# Altium project wikiduino-micro-rda5981.PrjPCB
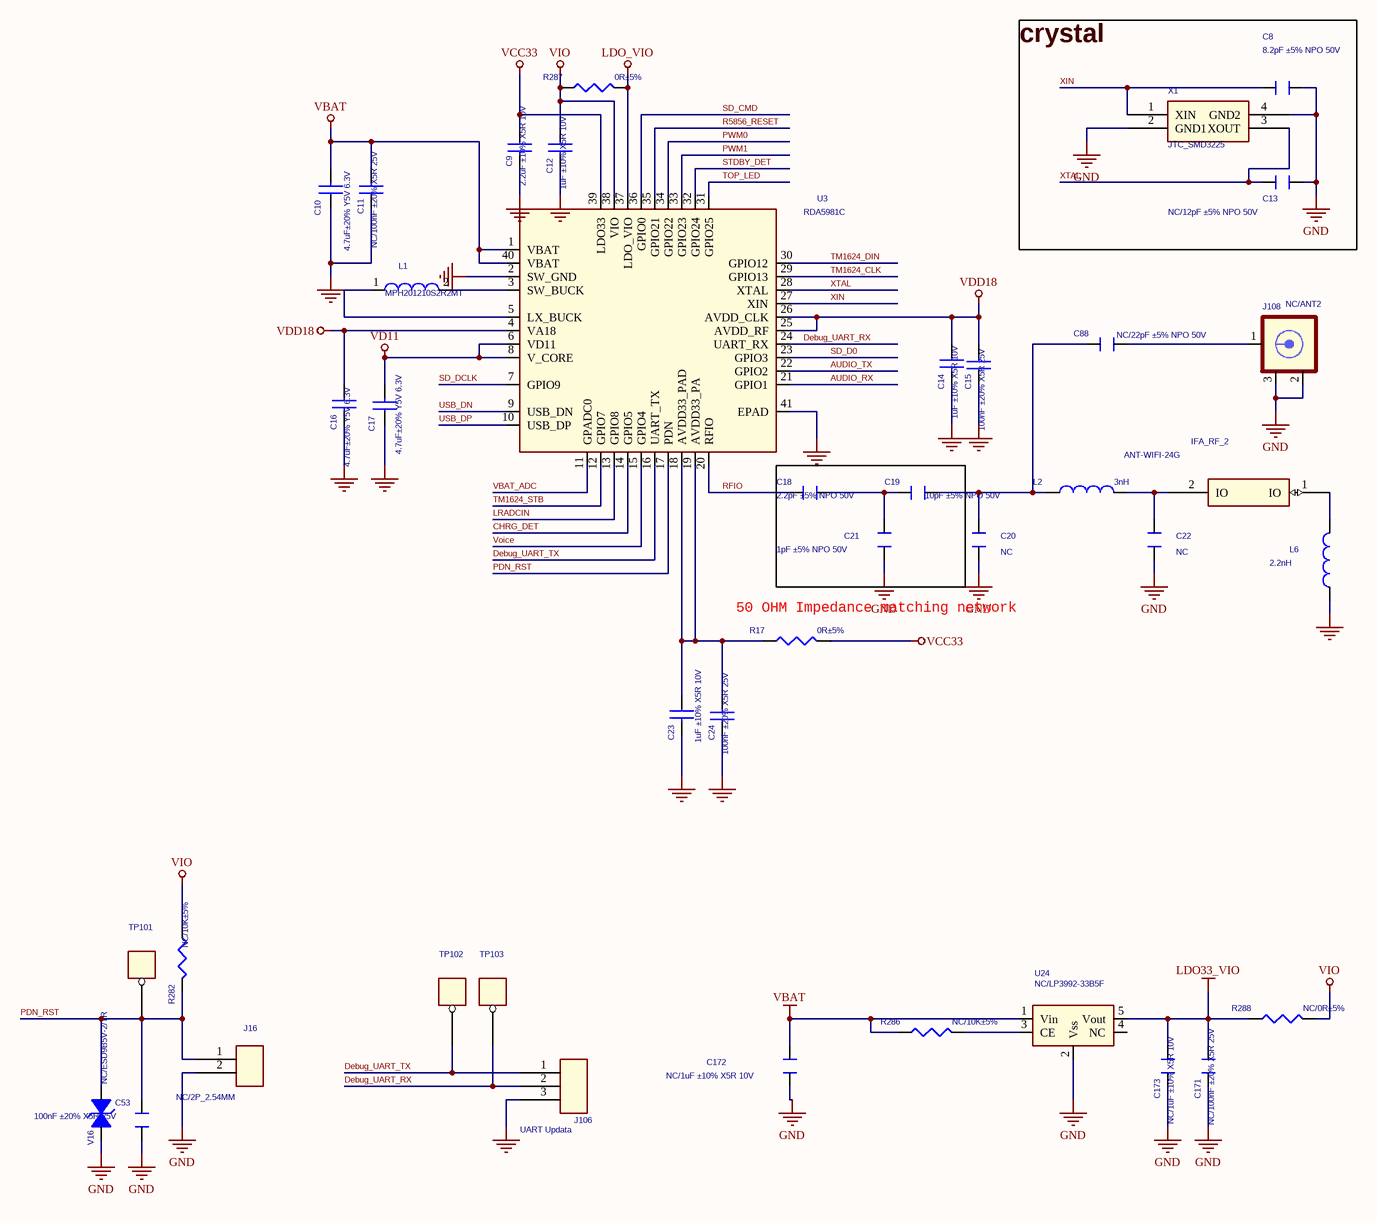
[diagram p0: RDA5981C.SchDoc]
2 sheets, 79 parts. Net scope: global (net labels, ports and power ports of the same name join across sheets).
Board file: wikiduino-micro-rda5981.PcbDoc
Sheets:
  RDA5981C.SchDoc
  POWER.SchDoc

## Sheet RDA5981C.SchDoc
size A3

### Parts
C8  8.2pF ±5% NPO 50V  [C0402]
C9  2.2uF ±10% X5R 10V  [C0402]
C10  4.7uF±20% Y5V 6.3V  [C0402]
C11  NC/100nF ±20% X5R 25V  [C0402]
C12  1uF ±10% X5R 10V  [C0402]
C13  NC/12pF ±5% NPO 50V  [C0402]
C14  1uF ±10% X5R 10V  [C0402]
C15  100nF ±20% X5R 25V  [C0402]
C16  4.7uF±20% Y5V 6.3V  [C0402]
C17  4.7uF±20% Y5V 6.3V  [C0402]
C18  2.2pF ±5% NPO 50V  [C0402]
C19  10pF ±5% NPO 50V  [C0402]
C20  NC  [C0402]
C21  1pF ±5% NPO 50V  [C0402]
C22  NC  [C0402]
C23  1uF ±10% X5R 10V  [C0402]
C24  100nF ±20% X5R 25V  [C0402]
C53  100nF ±20% X5R 25V  [C0402]
C88  NC/22pF ±5% NPO 50V  [C0402]
C171  NC/100nF ±20% X5R 25V  [C0402]
C172  NC/1uF ±10% X5R 10V  [C0402]
C173  NC/1uF ±10% X5R 10V  [C0402]
IFA_RF_2  ANT-WIFI-24G  [IFA_RF_1]
J16  NC/2P_2.54MM  [SIP100-2P]
J106  UART Updata  [SIP100-3P]
J108  NC/ANT2  [ANT]
L1  MPH201210S2R2MT  [L0805]
L2  3nH  [L0402]
L6  2.2nH  [L0402]
R17  0R±5%  [R0402]
R282  NC/10K±5%  [R0402]
R286  NC/10K±5%  [R0402]
R287  0R±5%  [R0402]
R288  NC/0R±5%  [R0402]
TP101  TP25RD  [TPC]  (value not drawn)
TP102  TP25RD  [TPC]  (value not drawn)
TP103  TP25RD  [TPC]  (value not drawn)
U3  RDA5981C  [QFN40-5X5-T1.0-RDA5981C]
U24  NC/LP3992-33B5F  [SOT23-6]
V16  NC/ESD9B5V-2/TR  [ESD0402]
X1  JTC_SMD3225  [SMD_3225]

### Blocks framed on the sheet
crystal: C8 C13 X1

### Nets
GND: C8.1 C9.2 C10.1 C11.1 C12.2 C13.1 C14.2 C15.1 C16.2 C17.1 C20.2 C21.2 C22.2 C23.2 C24.1 C53.1 C171.1 C172.1 C173.1 J16.2 J106.3 J108.2(SHIELD1) J108.3(SHIELD2) L6.1 U3.2(SW_GND) U3.41(EPAD) U24.2(Vss) V16.2(I/O2) X1.2(GND1) X1.4(GND2)
LDO33_VIO: C171.2 C173.2 R288.1 U24.5(Vout)
LDO_VIO: R287.2 U3.37(LDO_VIO)
VBAT: C10.2 C11.2 C172.2 R286.1 U3.1(VBAT) U3.40(VBAT) U24.1(Vin)
VCC33: C9.1 R17.2 U3.39(LDO33)
VD11: C17.2 U3.6(VD11) U3.8(V_CORE)
VDD18: C14.1 C15.2 C16.1 U3.4(VA18) U3.25(AVDD_RF) U3.26(AVDD_CLK)
VIO: C12.1 R282.1 R287.1 R288.2 U3.38(VIO)
AUDIO_RX: U3.21(GPIO1)
AUDIO_TX: U3.22(GPIO2)
CHRG_DET: U3.14(GPIO5)
Debug_UART_RX: J106.2 TP103.1(TP1) U3.24(UART_RX)
Debug_UART_TX: J106.1 TP102.1(TP1) U3.16(UART_TX)
LRADCIN: U3.13(GPIO8)
PDN_RST: C53.2 J16.1 R282.2 TP101.1(TP1) U3.17(PDN) V16.1(I/O1)
PWM0: U3.34(GPIO22)
PWM1: U3.33(GPIO23)
R5856_RESET: U3.35(GPIO21)
RFIO: C18.2 U3.20(RFIO)
SD_CMD: U3.36(GPIO0)
SD_D0: U3.23(GPIO3)
SD_DCLK: U3.7(GPIO9)
STDBY_DET: U3.32(GPIO24)
TM1624_CLK: U3.29(GPIO13)
TM1624_DIN: U3.30(GPIO12)
TM1624_STB: U3.12(GPIO7)
TOP_LED: U3.31(GPIO25)
USB_DN: U3.9(USB_DN)
USB_DP: U3.10(USB_DP)
VBAT_ADC: U3.11(GPADC0)
Voice: U3.15(GPIO4)
XIN: C8.2 U3.27(XIN) X1.1(XIN)
XTAL: C13.2 U3.28(XTAL) X1.3(XOUT)
NetC18_1: C18.1 C19.2 C21.1
NetC19_1: C19.1 C20.1 C88.2 L2.1
NetC22_1: C22.1 IFA_RF_2.2(IO) L2.2
NetC23_1: C23.1 C24.2 R17.1 U3.18(AVDD33_PAD) U3.19(AVDD33_PA)
NetC88_1: C88.1 J108.1(CENTER)
NetIFA_RF_2_1: IFA_RF_2.1(IO) L6.2
NetL1_1: L1.1 U3.5(LX_BUCK)
NetL1_2: L1.2 U3.3(SW_BUCK)
NetR286_2: R286.2 U24.3(CE)

Not connected (* = marked no-connect by the designer): U24 4(NC)

### Notes on the sheet
- (near R17) 50 OHM Impedance matching network

### Library data of the parts
C8 C13 C20-C22 C53 = CAPACITOR_0_Dup4: PAGE: 2
C9 C12 C14 C16 C23 = CAP NP_Dup6
C10 C17 = CAP NP_Dup4: Assembly: C0603
C11 C15 C24 = CAP NP_Dup5
C18 C19 C88 = CAPACITOR_Dup2
C171-C173 = CAPACITOR_Dup2: PAGE: 1
IFA_RF_2 = ANT-25G-R-CB_0
J16 = CON4_1
J106 = CON3
J108 = SMA/RF_0
L1 = INDUCTOR: RoHS Power Inductor 22uH 300mA H<1.8MM,CD32
L2 L6 = INDUCTOR_Dup1: PART_TYPE: L42; PART_NUMBER: L42-0201S3N320ACX0
R17 R282 = R_Dup2: ROOM: TFCARD&USB&KEY
R286-R288 = R_Dup3
TP101 TP102 = TEST_POINT: PAD_SM;TEST;0.025 ROUND; Part Number: G500-0000506; Type Package: SM PAD; BOM Notes: DNE; Compliance: NoData; Part Type: TEST POINT; Lifecycle: Full Production
TP103 = TEST_POINT: PAD_SM;TEST;0.025 ROUND; Part Number: G500-0000506; Compliance: NoData; BOM Notes: DNE; Type Package: SM PAD; Lifecycle: Full Production; Part Type: TEST POINT
U3 = RDA5981C_0
U24 = RT9266PE_12
V16 = Varistor: Mutilayer Varistor,,5.5V,10PF; Manufacturer: Inpaq; Part_Number: EB3.100NV05402A; Part_Name: Varistor
X1 = CRYSTAL-4_0: Crystal 24MHz 20pF 10ppm  -30 to +85; PART NUMBER: 7M24000004; Vendor: TXC; SPREADWIN PN: U3000019A

## Sheet POWER.SchDoc
size 386 x 304 mm
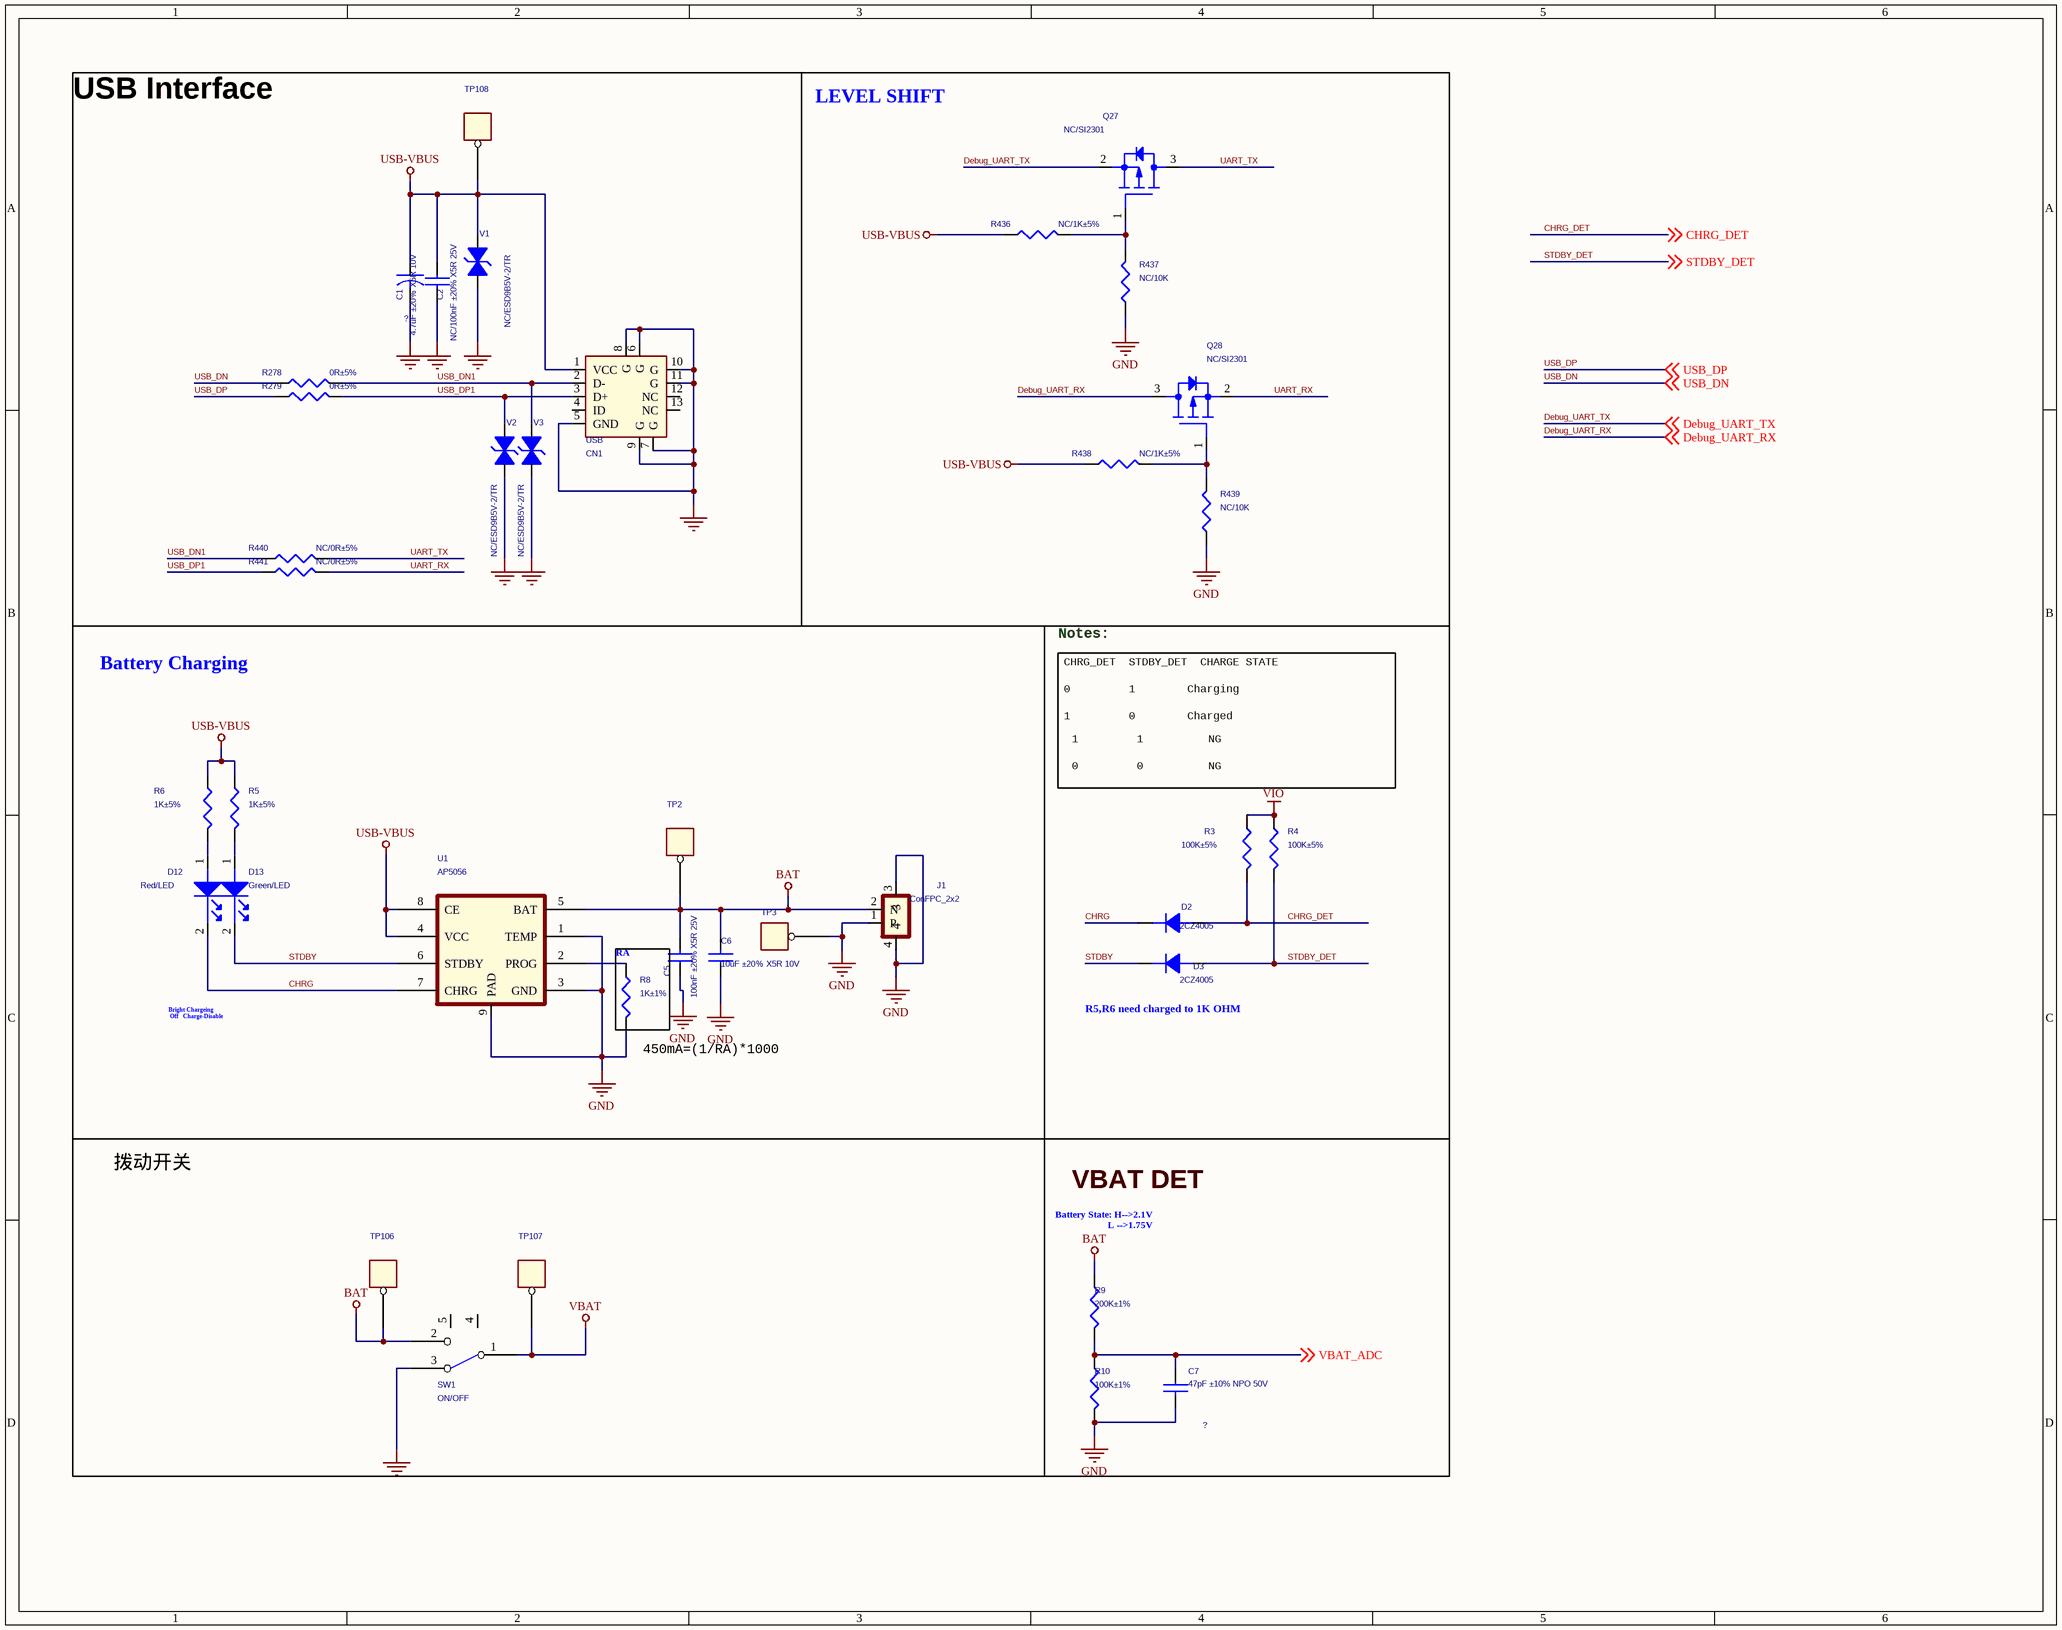
[diagram p1: POWER.SchDoc]

### Parts
C1  4.7uF ±20％ X5R 10V  [C0402]
C2  NC/100nF ±20% X5R 25V  [C0402]
C5  100nF ±20% X5R 25V  [C0402]
C6  10uF ±20％ X5R 10V  [C0603]
C7  47pF ±10% NPO 50V  [C0402]
CN1  USB  [USB_DIP5PA-GKFD]
D2  2CZ4005  [SOD-123]
D3  2CZ4005  [SOD-123]
D12  Red/LED  [LED0603]
D13  Green/LED  [LED0603]
J1  ConFPC_2x2  [PL2.0-2P-SMT]
Q27  NC/SI2301  [SOT-23]
Q28  NC/SI2301  [SOT-23]
R3  100K±5%  [R0402]
R4  100K±5%  [R0402]
R5  1K±5%  [R0402]
R6  1K±5%  [R0402]
R8  1K±1%  [R0402]
R9  200K±1%  [R0402]
R10  100K±1%  [R0402]
R278  0R±5%  [R0402]
R279  0R±5%  [R0402]
R436  NC/1K±5%  [R0402]
R437  NC/10K  [R0402]
R438  NC/1K±5%  [R0402]
R439  NC/10K  [R0402]
R440  NC/0R±5%  [R0402]
R441  NC/0R±5%  [R0402]
SW1  ON/OFF  [SW_1P2D-SK12D07VG3]
TP2  TP25RD  [TPC]  (value not drawn)
TP3  TP25RD  [TPC]  (value not drawn)
TP106  TP25RD  [TPC]  (value not drawn)
TP107  TP25RD  [TPC]  (value not drawn)
TP108  TP25RD  [TPC]  (value not drawn)
U1  AP5056  [SOP8_PAD]
V1  NC/ESD9B5V-2/TR  [ESD0402]
V2  NC/ESD9B5V-2/TR  [ESD0402]
V3  NC/ESD9B5V-2/TR  [ESD0402]

### Blocks framed on the sheet
USB Interface: C1 C2 CN1 R278 R279 R440 R441 TP108 V1-V3
LEVEL SHIFT: Q27 Q28 R436-R439
Battery Charging: C5 C6 D12 D13 J1 R5 R6 TP2 TP3 U1
Notes:: D2 D3 R3 R4
RA: R8
拨动开关: SW1 TP106 TP107
VBAT DET: C7 R9 R10

### Nets
BAT: C5.2 C6.2 J1.2(N) R9.1 SW1.2(NO) TP2.1(TP1) TP106.1(TP1) U1.5(BAT)
GND: C1.2 C2.2(Pin2) C5.1 C6.1 C7.2(Pin2) CN1.5(GND) CN1.6(G) CN1.7(G) CN1.8(G) CN1.9(G) CN1.10(G) CN1.11(G) J1.1(P) J1.3 J1.4 R8.1 R10.2 R437.1 R439.1 SW1.3(NC) TP3.1(TP1) U1.1(TEMP) U1.3(GND) U1.9(PAD) V1.2(I/O2) V2.2(I/O2) V3.2(I/O2)
USB-VBUS: C1.1 C2.1(Pin1) CN1.1(VCC) R5.2 R6.2 R436.1 R438.1 TP108.1(TP1) U1.4(VCC) U1.8(CE) V1.1(I/O1)
VBAT: SW1.1(COMMON) TP107.1(TP1)
VIO: R3.1 R4.1
CHRG: D2.2 D12.2(CATHODE) U1.7(CHRG)
CHRG_DET: D2.1 R3.2 ; off-sheet CHRG_DET
Debug_UART_RX: Q28.3(DRAIN) ; off-sheet Debug_UART_RX
Debug_UART_TX: Q27.2(SOURCE) ; off-sheet Debug_UART_TX
STDBY: D3.2 D13.2(CATHODE) U1.6(STDBY)
STDBY_DET: D3.1 R4.2 ; off-sheet STDBY_DET
UART_RX: Q28.2(SOURCE) R441.2
UART_TX: Q27.3(DRAIN) R440.2
USB_DN: R278.1 ; off-sheet USB_DN
USB_DN1: CN1.2(D-) R278.2 R440.1 V3.1(I/O1)
USB_DP: R279.1 ; off-sheet USB_DP
USB_DP1: CN1.3(D+) R279.2 R441.1 V2.1(I/O1)
VBAT_ADC: C7.1(Pin1) R9.2 R10.1 ; off-sheet VBAT_ADC
NetD12_1: D12.1(ANODE) R6.1
NetD13_1: D13.1(ANODE) R5.1
NetQ27_1: Q27.1(GATE) R436.2 R437.2
NetQ28_1: Q28.1(GATE) R438.2 R439.2
NetR8_2: R8.2 U1.2(PROG)

Not connected (* = marked no-connect by the designer): CN1 4(ID) 12(NC) 13(NC); SW1 4(NC) 5(NC)

### Notes on the sheet
- CHRG_DET  STDBY_DET  CHARGE STATE
- 0         1        Charging
- 1         0        Charged
- 1         1          NG
- 0         0          NG
- Bright Chargeing
  Off   Charge-Disable
- (near D3) R5,R6 need charged to 1K OHM
- (near R8) 450mA=(1/RA)*1000
- Battery State: H-->2.1V
  L -->1.75V

### Library data of the parts
C1 = CAP_Dup8: CISPartType: Capacitor\0603; PART_NUMBER: 105-35282-3475; Tolerance: +/-20%; AtherosDescription: CAP,0603,X5R,4.7uF,20%,6.3V; ATHEROS KEY: 032-475CM-001
C2 = CAP: PART_NUMBER: 105-35273-2104; CISPartType: Capacitor\0402; Tolerance: +/-10%; ATHEROS KEY: 031-104CK-002; AtherosDescription: CAP,0402,X5R,0.1uF,+/-10%,10V; Voltage: ?
C5 = CAP NP_Dup6
C6 = CAP NP_Dup4: Assembly: C0603
C7 = CAP_Dup9: PART_NUMBER: 105-35067-2470; CISPartType: Capacitor\0402; Tolerance: +/-5%; ATHEROS KEY: 031-470CJ-000; AtherosDescription: CAP,0402,NPO,47pF,+/-5%,50V; Voltage: ?
CN1 = USB TYPE A_5
D2 D3 = D_0: Allegro PCB Footprint: d2513A
D12 D13 = LED_0_Dup1
J1 = CON8_1
Q27 Q28 = PWRMOSFET_EP_GSD_0
R3-R6 R8 = RESISTOR_Dup4
R9 R10 R437 R439 = R_Dup5
R278 R279 R436 R438 R440 R441 = R_Dup2
SW1 = SW KEY-SPDT_0
TP2 TP3 TP106-TP108 = TEST_POINT: as TP103 on sheet RDA5981C; Lifecycle: Full Production; Part Type: TEST POINT
U1 = AP5057 _1
V1-V3 = Varistor: as V16 on sheet RDA5981C; Part_Name: Varistor

## Nets that join several sheets
GND: RDA5981C (30 pins), POWER (27 pins)
VBAT: RDA5981C (7 pins), POWER (SW1.1 TP107.1)
VIO: RDA5981C (5 pins), POWER (R3.1 R4.1)
CHRG_DET: RDA5981C (U3.14), POWER (D2.1 R3.2)
Debug_UART_RX: RDA5981C (J106.2 TP103.1 U3.24), POWER (Q28.3)
Debug_UART_TX: RDA5981C (J106.1 TP102.1 U3.16), POWER (Q27.2)
STDBY_DET: RDA5981C (U3.32), POWER (D3.1 R4.2)
USB_DN: RDA5981C (U3.9), POWER (R278.1)
USB_DP: RDA5981C (U3.10), POWER (R279.1)
VBAT_ADC: RDA5981C (U3.11), POWER (C7.1 R9.2 R10.1)